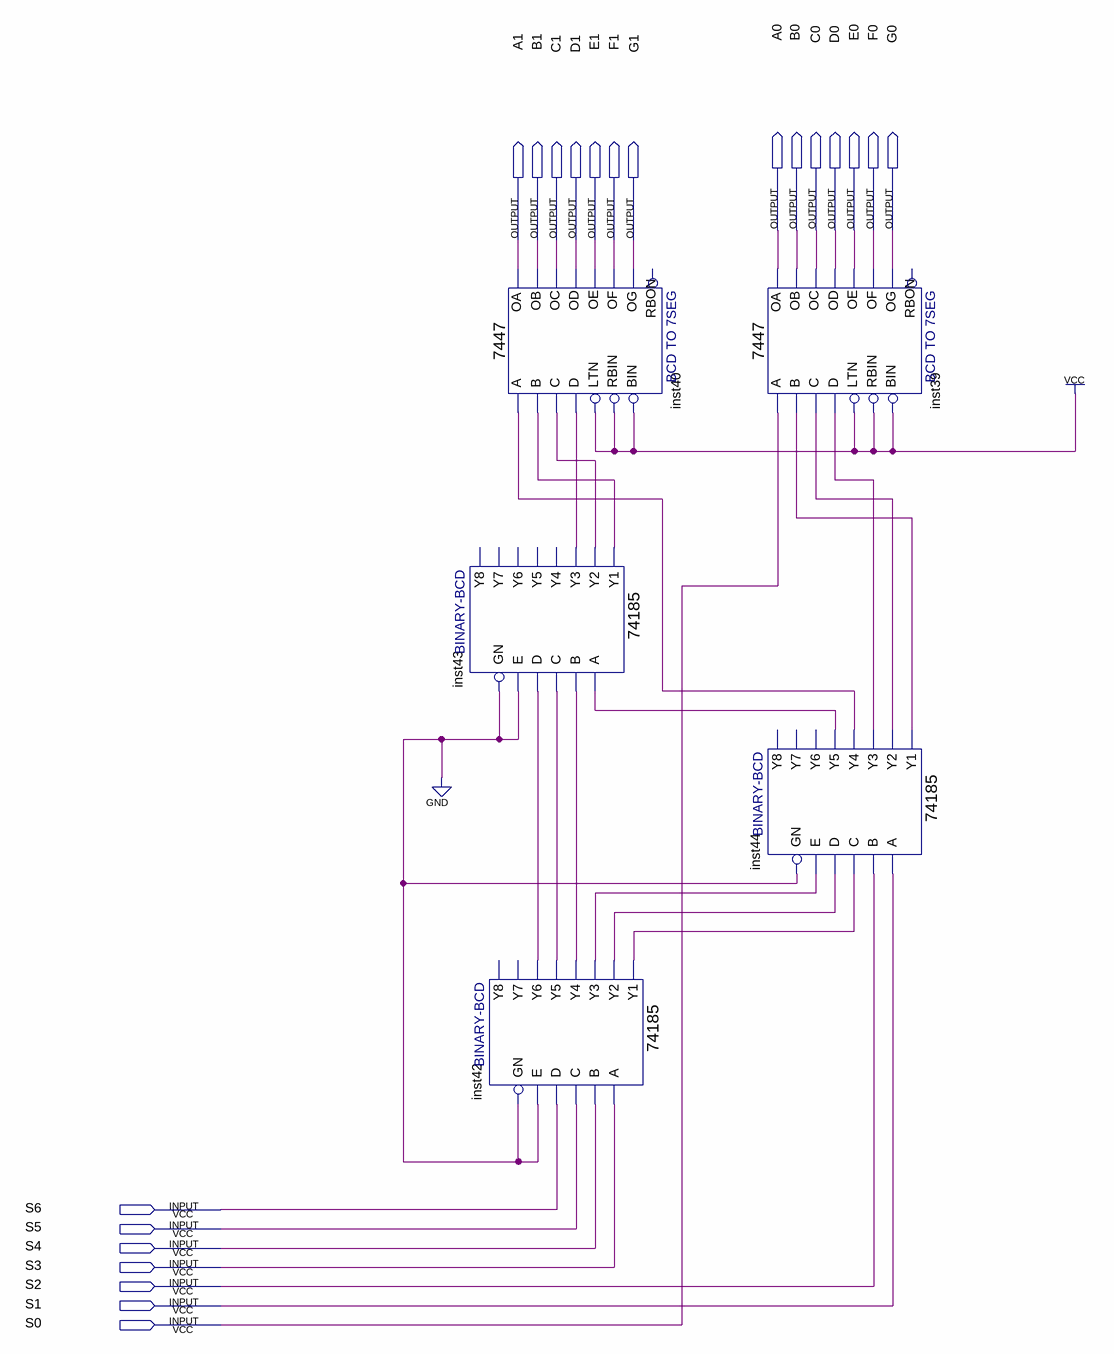
[diagram p0: schematic sheet]
// Quartus schematic show_module.bdf as structural Verilog: 5 symbols, 21 pins
module show_module (
  input  S6,
  input  S5,
  input  S4,
  input  S3,
  input  S2,
  input  S1,
  input  S0,
  output A0,
  output B0,
  output C0,
  output D0,
  output E0,
  output F0,
  output G0,
  output A1,
  output B1,
  output C1,
  output D1,
  output E1,
  output F1,
  output G1
);

  wire inst42_y1, inst42_y2, inst42_y3, inst42_y4, inst42_y5, inst42_y6, inst43_y1, inst43_y2, inst43_y3,
       inst44_y1, inst44_y2, inst44_y3, inst44_y4, inst44_y5;

  \7447  inst40 (
    .LTN(1'b1), .B(inst43_y1), .C(inst43_y2), .D(inst43_y3), .RBIN(1'b1), .BIN(1'b1), .A(inst44_y4), .OB(B1),
    .OC(C1), .OE(E1), .OD(D1), .OF(F1), .OG(G1), .OA(A1));  // open: RBON
  \74185  inst43 (
    .A(inst44_y5), .B(inst42_y4), .D(inst42_y6), .C(inst42_y5), .E(1'b0), .GN(1'b0), .Y1(inst43_y1),
    .Y3(inst43_y3), .Y2(inst43_y2));  // open: Y5, Y4, Y6, Y8, Y7
  \74185  inst42 (
    .A(S3), .B(S4), .D(S6), .C(S5), .E(1'b0), .GN(1'b0), .Y1(inst42_y1), .Y3(inst42_y3), .Y2(inst42_y2),
    .Y5(inst42_y5), .Y4(inst42_y4), .Y6(inst42_y6));  // open: Y8, Y7
  \7447  inst39 (
    .LTN(1'b1), .B(inst44_y1), .C(inst44_y2), .D(inst44_y3), .RBIN(1'b1), .BIN(1'b1), .A(S0), .OB(B0),
    .OC(C0), .OE(E0), .OD(D0), .OF(F0), .OG(G0), .OA(A0));  // open: RBON
  \74185  inst44 (
    .A(S1), .B(S2), .D(inst42_y2), .C(inst42_y1), .E(inst42_y3), .GN(1'b0), .Y1(inst44_y1), .Y3(inst44_y3),
    .Y2(inst44_y2), .Y5(inst44_y5), .Y4(inst44_y4));  // open: Y6, Y8, Y7
endmodule
